# EAGLE design OTEStamperCamera (EAGLE 9.6.2)
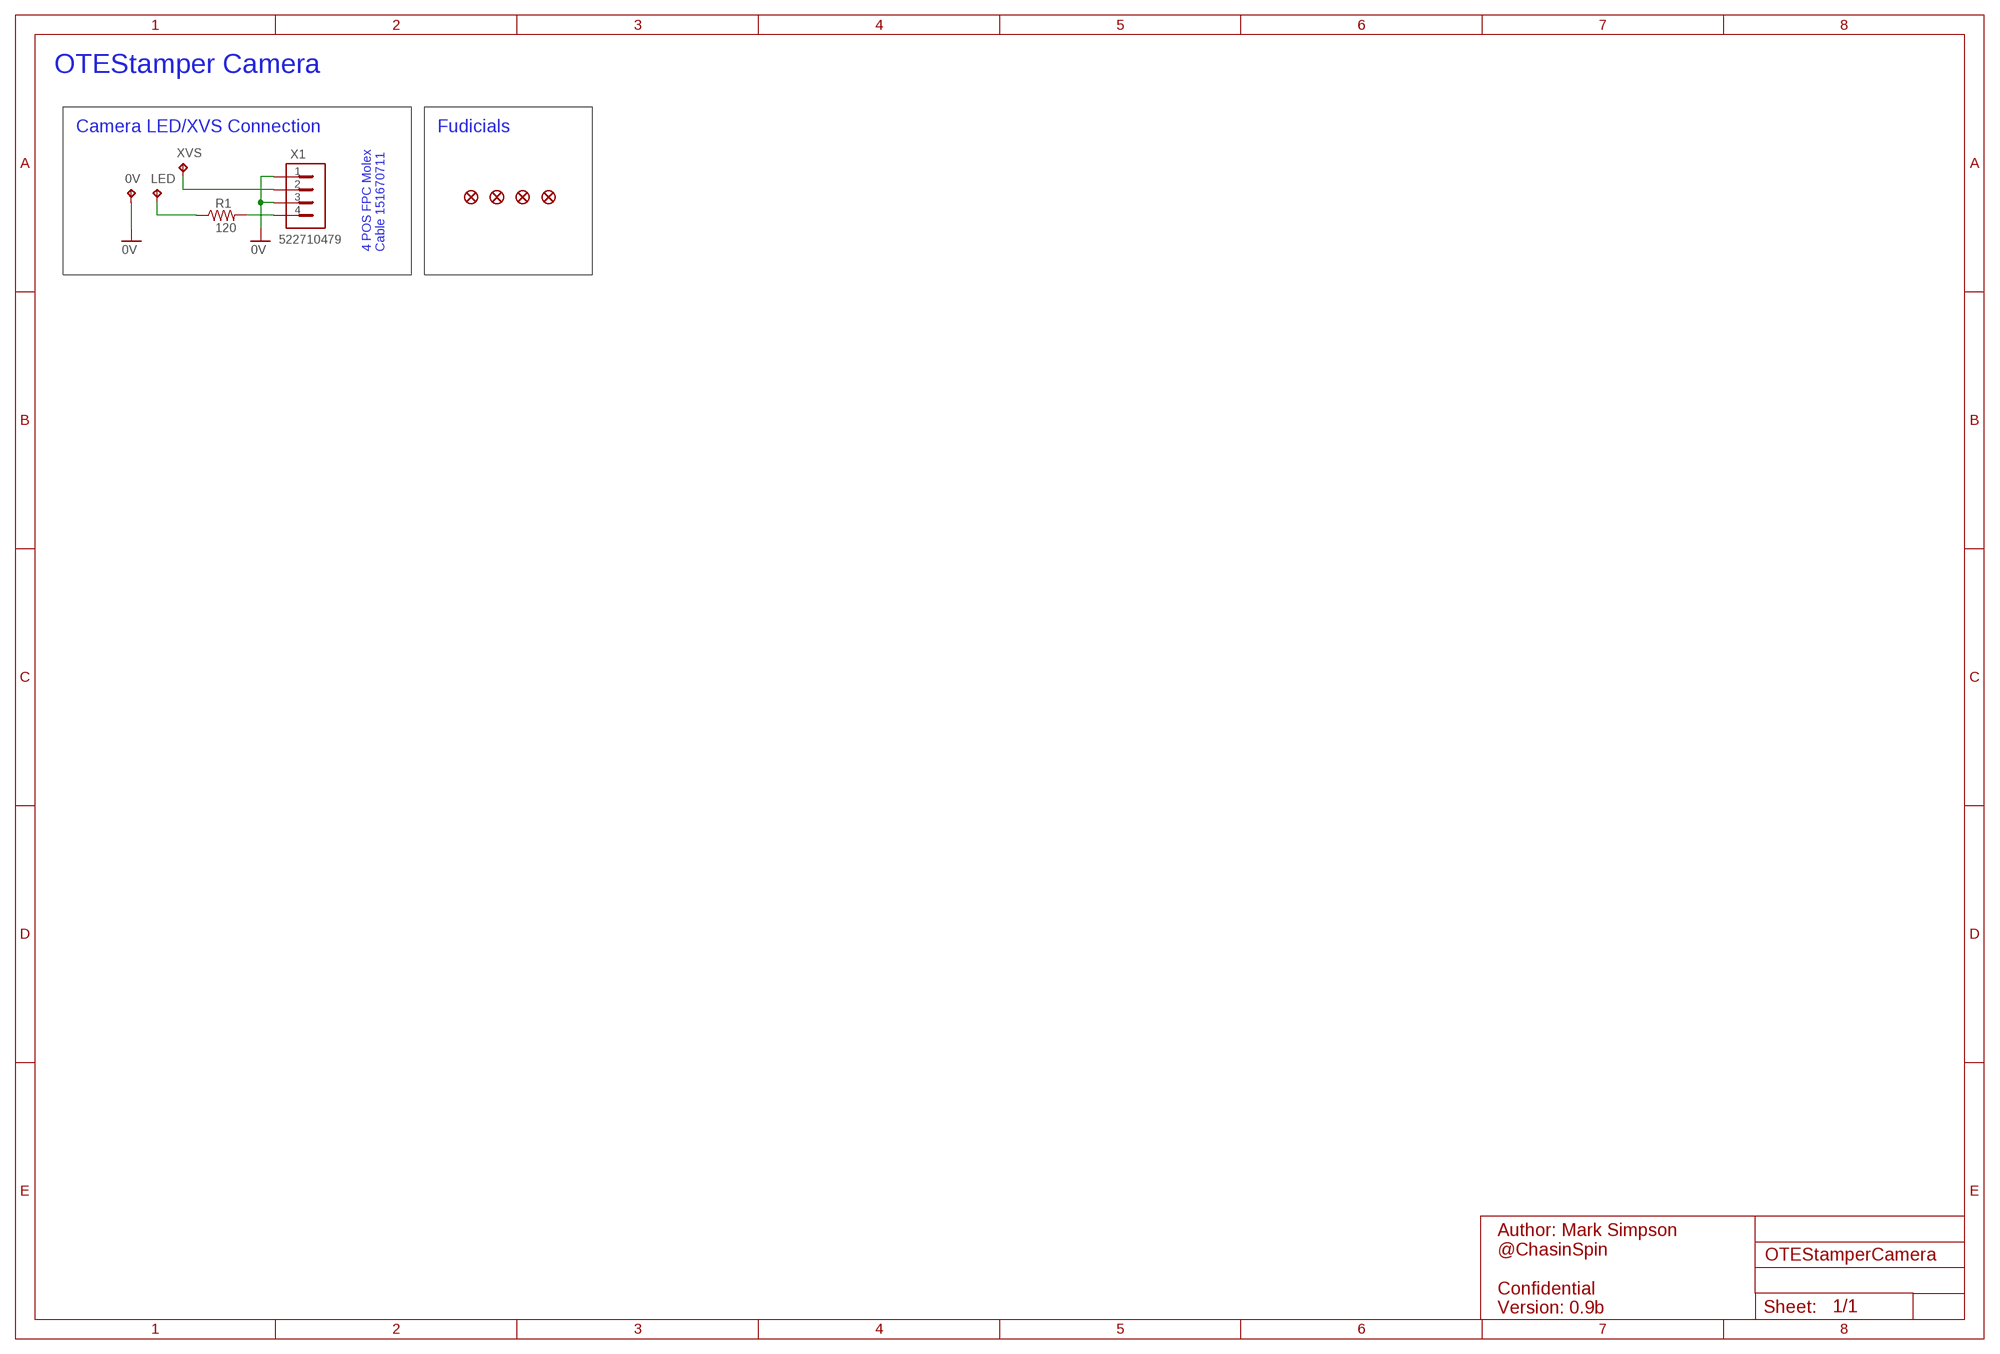
[diagram p0: schematic, sheet 1]

## Parts
0V  LED  TPTP16SQ  [TP16SQ]
FD1  FIDUCIALUFIDUCIAL  [FIDUCIAL-MICRO]
FD2  FIDUCIALUFIDUCIAL  [FIDUCIAL-MICRO]
FD3  FIDUCIALUFIDUCIAL  [FIDUCIAL-MICRO]
FD4  FIDUCIALUFIDUCIAL  [FIDUCIAL-MICRO]
LED  LED  TPTP16SQ  [TP16SQ]
R1  120  R-US  [R0603]
X1  522710479  [522710479]
XVS  TPTP16SQ  [TP16SQ]

## Nets
0V: 0V.TP X1.1 X1.3
N$1: R1.2 X1.4
N$2: X1.2 XVS.TP
N$3: LED.TP R1.1

## Notes on the sheet
- OTEStamper Camera
- Camera LED/XVS Connection | Fudicials
- 4 POS FPC Molex
  Cable 151670711
- Author: Mark Simpson
  @ChasinSpin
  
  Confidential
  Version: 0.9b

## Library data of the parts
0V LED XVS = testpad:TP: Test pad
FD1-FD4 = SkyFall:FIDUCIAL: Fiducial Alignment Points Point-of-reference for pick-and-place machines and other optical instruments.
R1 = SkyFall:R-US: RESISTOR, US symbol
X1 = SkyFall:522710479: Molex 522710479 FFC, FFPC Connector 4Pos 1MM R/A Molex 522710479 FFC, FFPC Connector 4Pos 1MM R/A(Datasheet <https://tools.molex.com/pdm_docs/sd/522710479_sd.pdf>)

## Board
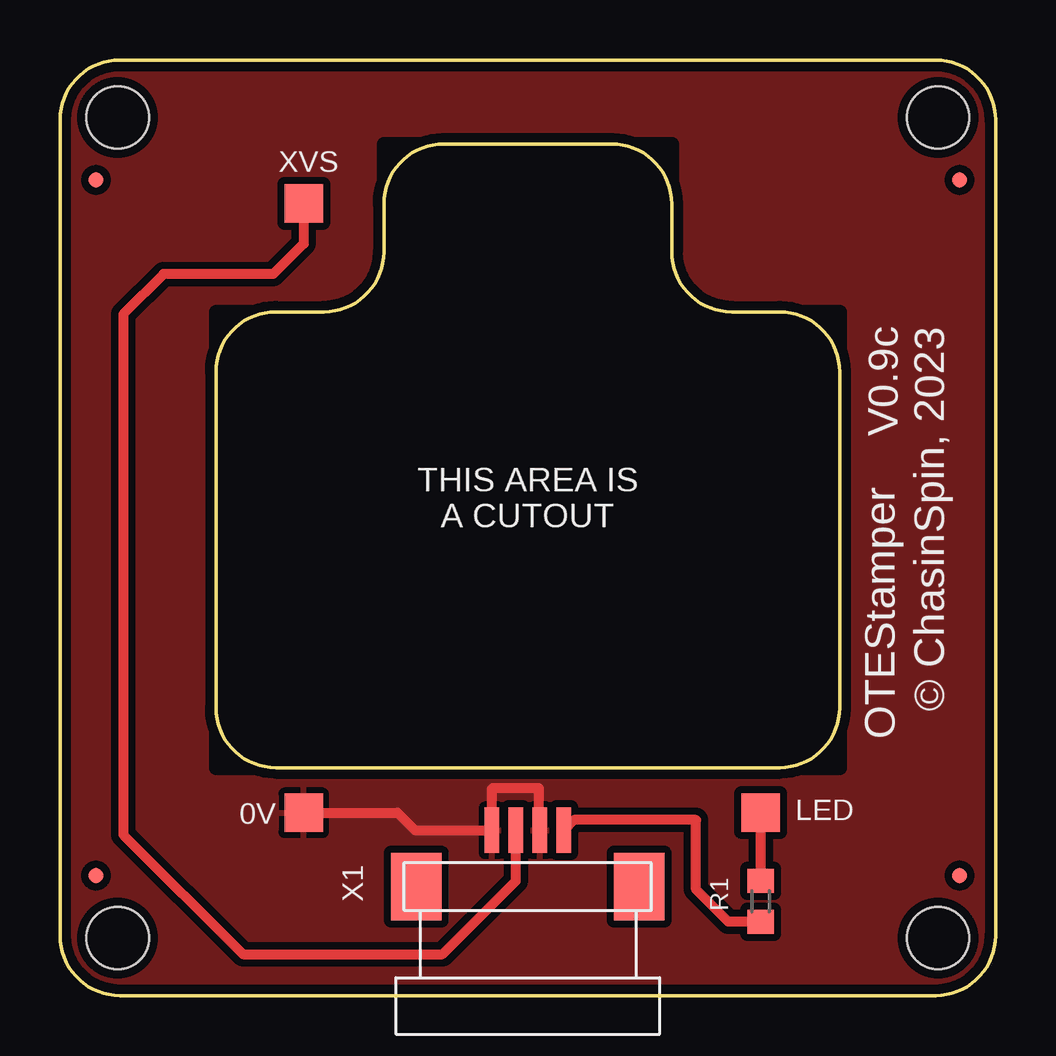
[diagram p1: board, top side]
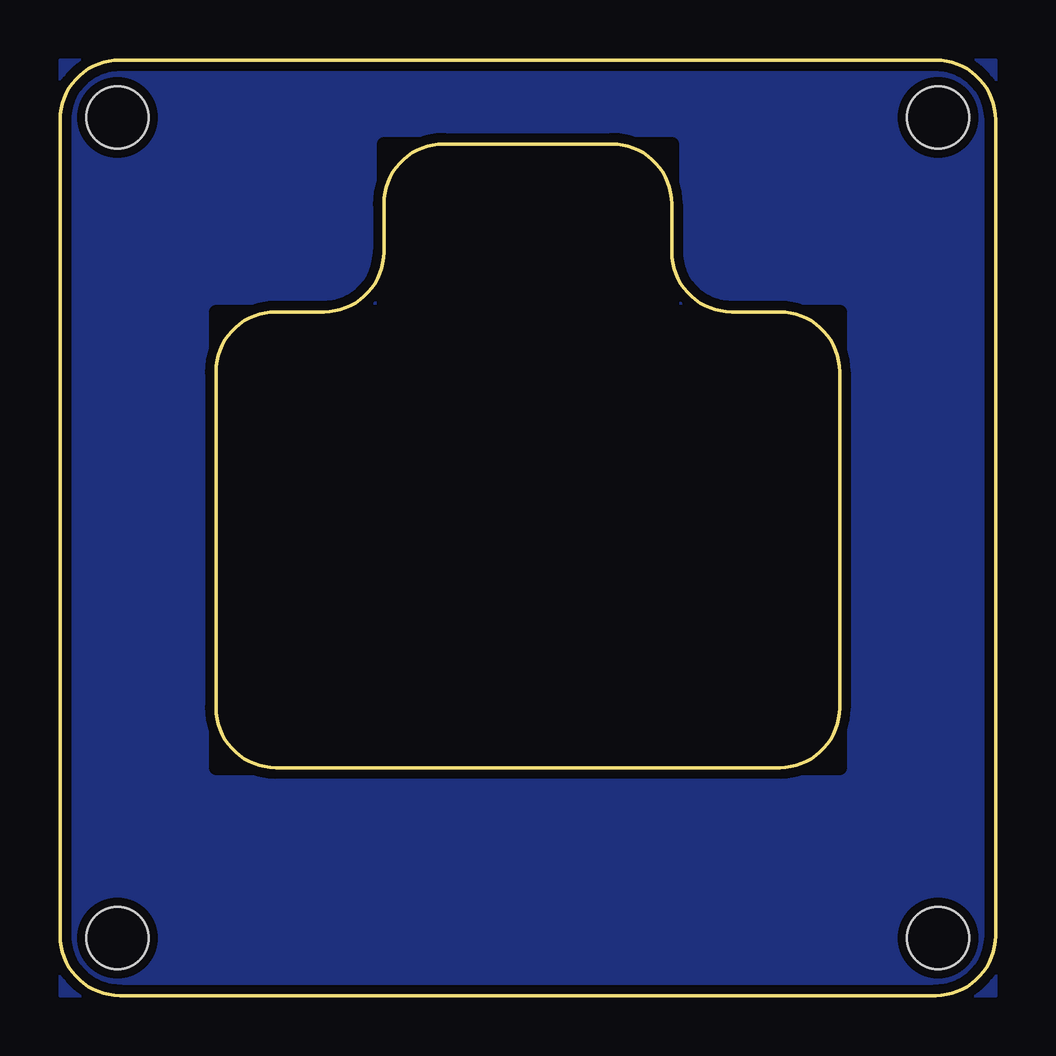
[diagram p2: board, bottom side, seen from below]

Size 39 x 39 mm. Coordinates in mm from the lower left corner, seen from the top.
Outline: 0,2.5 0,36.5 arc-90 2.5,39 36.5,39 arc-90 39,36.5 39,2.5 arc-90 36.5,0 2.5,0 arc-90 0,2.5
Outline: 6.5,26 6.5,12 arc90 9,9.5 30,9.5 arc90 32.5,12 32.5,26 arc90 30,28.5 28,28.5 arc-90 25.5,31 25.5,33 arc90 23,35.5 16,35.5 arc90 13.5,33 13.5,31 arc-90 11,28.5 9,28.5 arc90 6.5,26
Copper layers (1*16): Top 0.035559375mm / dielectric 1.6mm / Bottom 0.035559375mm
Design rules "oshpark-2layer": minimum track width 6mil, minimum drill 10mil, track to track 6mil, track to pad 6mil, pad to pad 6mil, via to via 6mil, smd to smd 6mil, copper to edge 15mil, drill to drill 6mil, minimum pad ring 5mil, minimum via ring 5mil, stop-mask expansion 2.5mil, vias tented up to drill 0mil, thermal gap 10mil
Holes 2.6 mm at 2.4,2.4 36.6,2.4 36.6,36.6 2.4,36.6
tRestrict: area 6.5,9.5 to 32.5,28.5; area 13.5,28.5 to 25.5,35.5
bRestrict: area 6.5,9.5 to 32.5,28.5; area 13.5,28.5 to 25.5,35.5

### Footprints (pad centres in the part's own frame; a part is rotated, then mirrored left to right if it is on the bottom)
TP16SQ = smd 1.6 x 1.6: TP 0,0
FIDUCIAL-MICRO = smd 0.635 x 0.635: 1 0,0
R0603 = smd 1 x 1.1: 1 -0.85,0; 2 0.85,0
522710479 = smd 0.6 x 1.9: 1 -1.5,0.95; 2 -0.5,0.95; 3 0.5,0.95; 4 1.5,0.95 | smd 2.1 x 2.8: 5 -4.65,-1.4; 6 4.65,-1.4

### Placement (x,y rotation side)
0V  10.16,7.62 0 top
FD1  1.5,34 0 top
FD2  37.5,5 0 top
FD3  37.5,34 0 top
FD4  1.5,5 0 top
LED  29.21,7.62 0 top
R1  29.21,3.92 270 top
X1  19.5,5.94 0 top
XVS  10.16,33.02 0 top

### Tracks (layer width: path | path; a pad name or v marks a point on that pad's centre or on a via)
0V
  Top 0.406: 0V.TP 14.07,7.62 14.8,6.89 X1.1 18,8.6 18.03,8.64 19.96,8.64 19.96,6.93 X1.3
  pour Top (isolate 0.305): 0,0 0,39 39,39 39,0
  pour Bottom (isolate 0.305): 0,0 0,39 39,39 39,0
N$1
  Top 0.406: R1.2 27.86,3.07 26.52,4.42 26.52,7.32 21.42,7.32 X1.4
N$2
  Top 0.406: XVS.TP 10.16,31.34 8.89,30.07 4.32,30.07 2.64,28.4 2.64,6.71 7.63,1.72 15.95,1.72 19,4.78 X1.2
N$3
  Top 0.406: R1.1 LED.TP

### Text on the board
tNames: V0.9c | © ChasinSpin, 2023 | THIS AREA IS / A CUTOUT | OTEStamper